# Altium schematic sheet RemoteControlPowerBoard.SchDoc
size A
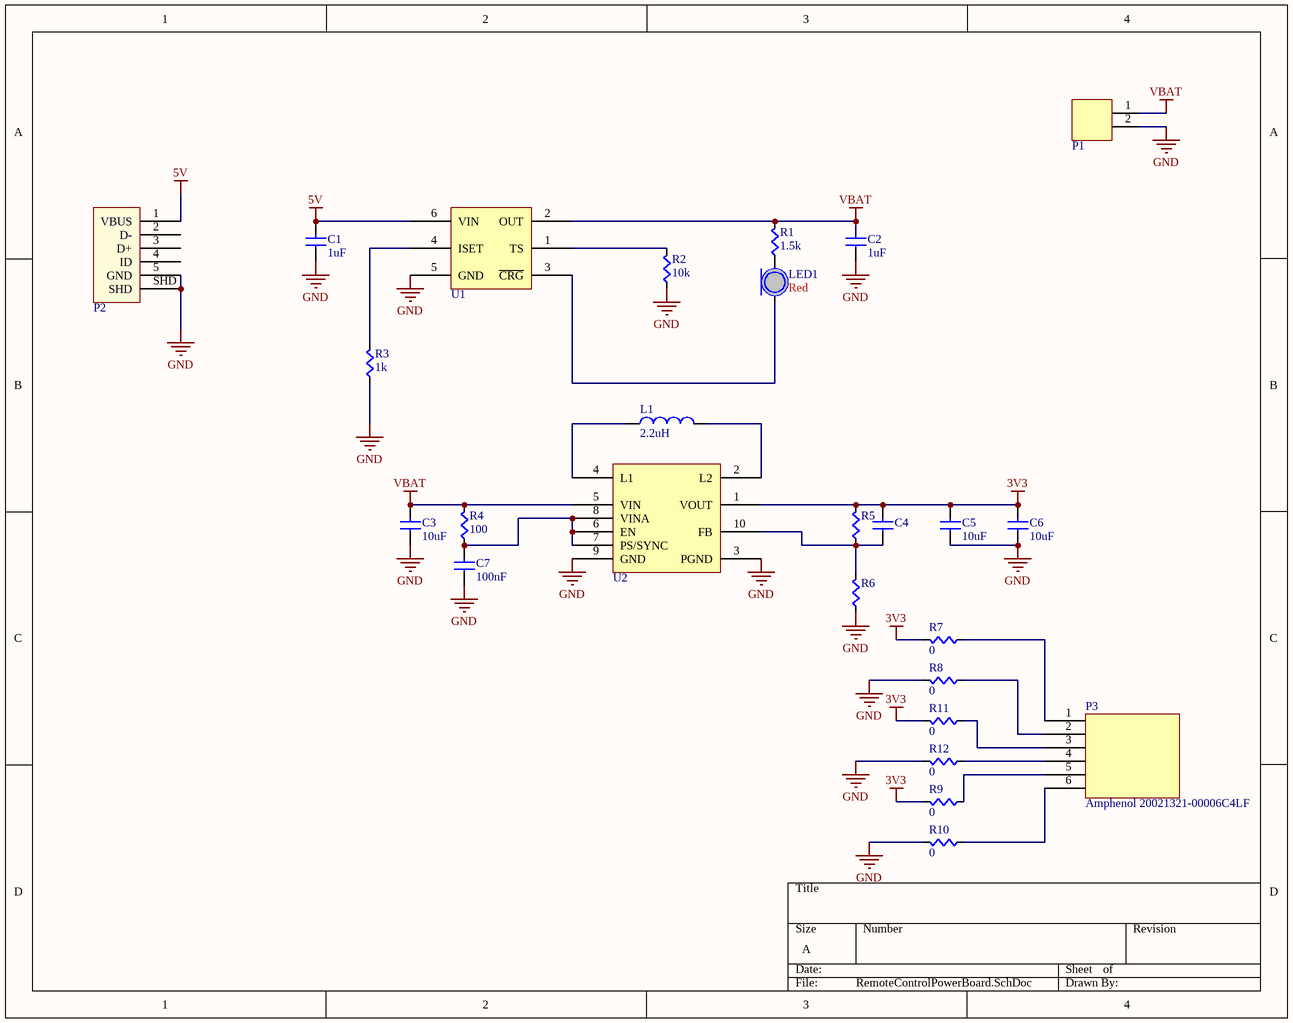
[diagram p0: RemoteControlPowerBoard.SchDoc]

## Parts
C1  value 1uF  [CAPC0603]  (hidden comment: Cap)
C2  value 1uF  [CAPC0603]  (hidden comment: Cap)
C3  value 10uF  [CAPC0603]  (hidden comment: Cap)
C4  Cap  [CAPC0603]  (value not drawn)
C5  value 10uF  [CAPC0603]  (hidden comment: Cap)
C6  value 10uF  [CAPC0603]  (hidden comment: Cap)
C7  value 100nF  [CAPC0603]  (hidden comment: Cap)
L1  Inductance: 2.2uH  [LQH3NPZ2R2MMEL]  (hidden comment: LQH3NPZ2R2MMEL)
LED1  Color: Red  [LED0603]  (hidden comment: LED)
P1  2-pin Horz Sherlock  [MOLEX-HDR-1X2-SHERLOCK-HORZ]  (value not drawn)
P2  UX60SC-MB-5ST  [UX60SC-MB-5ST]  (value not drawn)
P3  Amphenol 20021321-00006C4LF  [Amphenol FCI 20021321-00006C4LF - duplicate]
R1  value 1.5k  [RES0603]  (hidden comment: Res)
R2  value 10k  [RES0603]  (hidden comment: Res)
R3  value 1k  [RES0603]  (hidden comment: Res)
R4  value 100  [RES0603]  (hidden comment: Res)
R5  Res  [RES0603]  (value not drawn)
R6  Res  [RES0603]  (value not drawn)
R7  value 0  [RES0603]  (hidden comment: Res)
R8  value 0  [RES0603]  (hidden comment: Res)
R9  value 0  [RES0603]  (hidden comment: Res)
R10  value 0  [RES0603]  (hidden comment: Res)
R11  value 0  [RES0603]  (hidden comment: Res)
R12  value 0  [RES0603]  (hidden comment: Res)
U1  BQ21040  [BQ21040DBVT]  (value not drawn)
U2  TPS63000DRCR  [TPS63000DRCR]  (value not drawn)

## Nets
3V3: C4.1(A) C5.1(A) C6.1(A) R5.1(A) R7.1(A) R9.1(A) R11.1(A) U2.1(VOUT)
5V: C1.1(A) P2.1(VBUS) U1.6(VIN)
GND: C1.2(B) C2.2(B) C3.2(B) C5.2(B) C6.2(B) C7.2(B) P1.2 P2.5(GND) P2.SHD R2.2(B) R3.2(B) R6.2(B) R8.1(A) R10.1(A) R12.1(A) U1.5(GND) U2.3(PGND) U2.9(GND)
VBAT: C2.1(A) C3.1(A) P1.1 R1.1(A) R4.1(A) U1.2(OUT) U2.5(VIN)
NetC4_2: C4.2(B) R5.2(B) R6.1(A) U2.10(FB)
NetC7_1: C7.1(A) R4.2(B) U2.6(EN) U2.7(PS/SYNC) U2.8(VINA)
NetL1_1: L1.1(A) U2.4(L1)
NetL1_2: L1.2(B) U2.2(L2)
NetLED1_A: LED1.A R1.2(B)
NetLED1_C: LED1.C U1.3(~{CRG})
NetP3_1: P3.1 R7.2(B)
NetP3_2: P3.2 R8.2(B)
NetP3_3: P3.3 R11.2(B)
NetP3_4: P3.4 R12.2(B)
NetP3_5: P3.5 R9.2(B)
NetP3_6: P3.6 R10.2(B)
NetR2_1: R2.1(A) U1.1(TS)
NetR3_1: R3.1(A) U1.4(ISET)

Not connected (* = marked no-connect by the designer): P2 2(D-) 3(D+) 4(ID)

## Library data of the parts
L1 = LQH3NPZ2R2MMEL: Manufacturer 1: Murata Electronics North America; Supplier 1: Digi-Key; Supplier Part Number 1: 490-15973-1-ND; Manufacturer Part Number 1: LQH3NPZ2R2MMEL
P1 = MOLEX-HDR-1x2-SHERLOCK_RA: Header, Molex, 2mm Pitch Sherlock Header, Single Row, Horizontal, 2 Circuits, Length 3.3mm,  0353630260; Manufacturer: Molex Inc; Manufacturer Part Number: 0353630260; Supplier Part Number 1: WM18931-ND; Supplier 1: Digi-Key
P2 = UX60SC-MB-5ST: USB Mini B Metal Shield SMT; Supplier 1: Digi-Key; Supplier Part Number 1: H11671CT-ND
P3 = Amphenol FCI 20021321-00006C4LF: 6 Position Receptacle Connector 0.050" (1.27mm) Surface Mount Gold; Manufacturer 1: Amphenol FCI; Manufacturer Part Number 1: 20021321-00006C4LF; Supplier 1: Digi-Key; Supplier Part Number 1: 609-3704-1-ND; ComponentLink1URL: *; ComponentLink1URL: https://www.digikey.com/product-detail/en/amphenol-fci/20021321-00006C4LF/609-3704-1-ND/2209148; ComponentLink1Description: Website
U1 = BQ21040: IC BAT CHG LI-ION 1 CELL SOT23-6; Manufacturer 1: Texas Instruments; ComponentLink1Description: Datasheet; ComponentLink1URL: http://www.ti.com/lit/ds/symlink/bq21040.pdf; ComponentLink2Description: Website; ComponentLink2URL: http://www.ti.com/product/BQ21040/description; Supplier 1: Digi-Key; Supplier Part Number 1: 296-44196-1-ND; Manufacturer Part Number 1: BQ21040
U2 = TPS63000DRCR: Buck-Boost Switching Regulator IC Positive Adjustable 1.2V 1 Output 1.6A (Switch) 10-VFDFN Exposed Pad; Manufacturer 1: Texas Instruments; ComponentLink1Description: Datasheet; ComponentLink1URL: http://www.ti.com/lit/ds/symlink/tps63002.pdf; ComponentLink2Description: Website; ComponentLink2URL: http://www.ti.com/product/TPS63002/description; Supplier 1: Digi-Key; Supplier Part Number 1: 296-19641-1-ND; Manufacturer Part Number 1: TPS63000DRCR
C1-C7 = Cap: Supplier 1: Digi-Key
  C7: Supplier Part Number 1: 1276-1000-1-ND
LED1 = LED: Supplier 1: Digi-Key; Supplier Part Number 1: 754-1122-1-ND
R1-R12 = Res: Supplier 1: Digi-Key
  R2: Supplier Part Number 1: RMCF0603JT10K0CT-ND